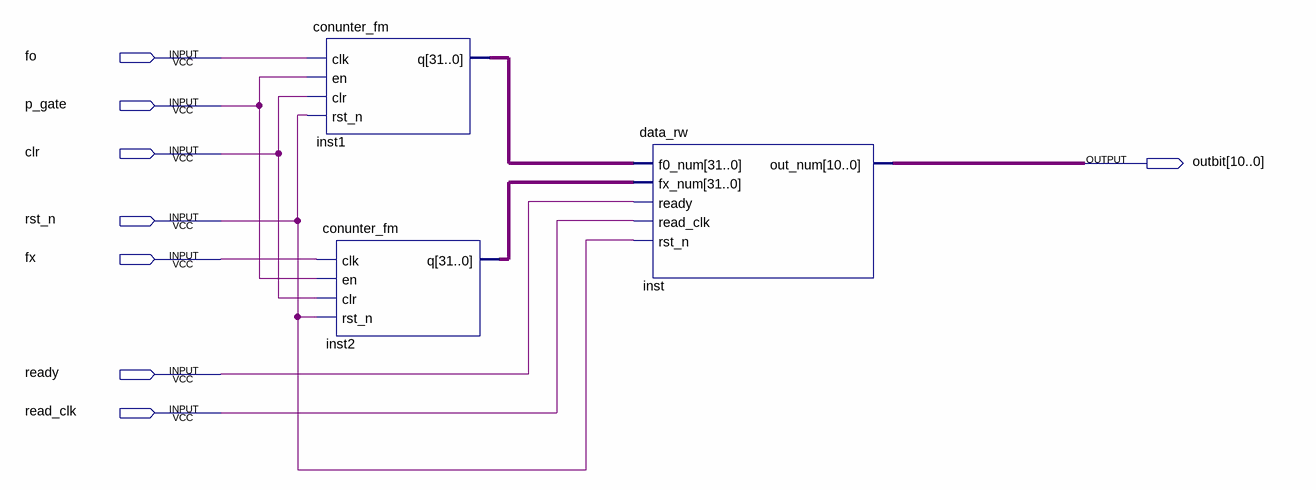
[diagram p0: schematic sheet]
// Quartus schematic fm.bdf as structural Verilog: 3 symbols, 8 pins
module fm (
  input  fo,
  input  p_gate,
  input  clr,
  input  rst_n,
  input  fx,
  input  ready,
  input  read_clk,
  output [10:0] outbit
);

  wire [31:0] inst1_q, inst2_q;

  conunter_fm inst1 (.clk(fo), .en(p_gate), .clr(clr), .rst_n(rst_n), .q(inst1_q));
  conunter_fm inst2 (.clk(fx), .en(p_gate), .clr(clr), .rst_n(rst_n), .q(inst2_q));
  data_rw inst (
    .f0_num(inst1_q), .fx_num(inst2_q), .ready(ready), .read_clk(read_clk), .rst_n(rst_n), .out_num(outbit));
endmodule
